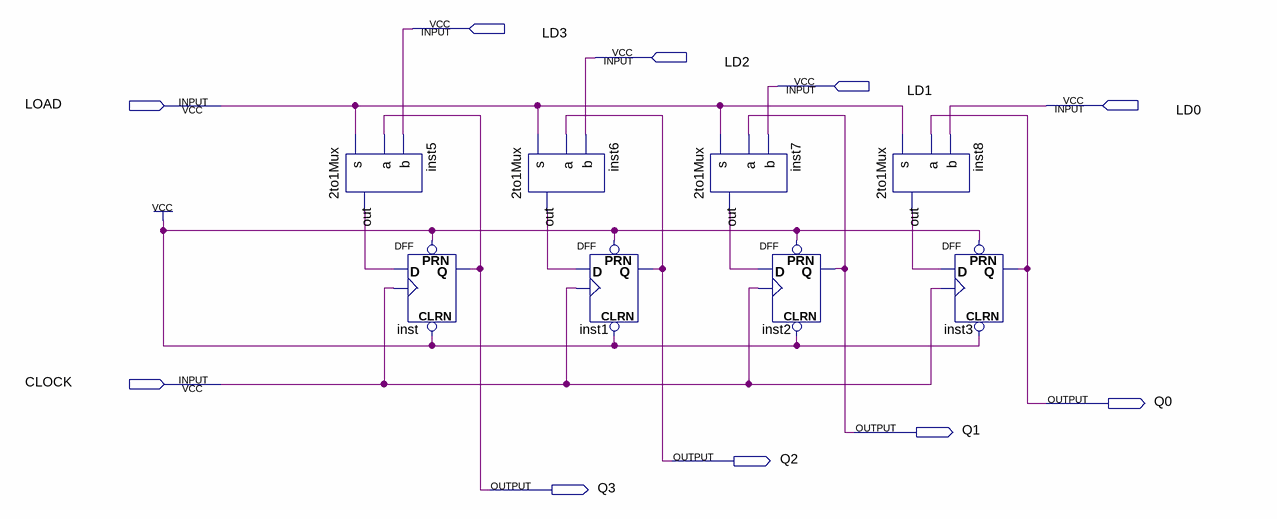
[diagram p0: schematic sheet]
// Quartus schematic register.bdf as structural Verilog: 8 symbols, 10 pins
module register (
  input  LD3,
  input  LD2,
  input  LD1,
  input  LOAD,
  input  LD0,
  input  CLOCK,
  output Q0,
  output Q1,
  output Q2,
  output Q3
);

  wire inst5_out, inst6_out, inst7_out, inst8_out;

  \2to1Mux  inst5 (.a(Q3), .s(LOAD), .b(LD3), .out(inst5_out));
  DFF inst (.CLRN(1'b1), .CLK(CLOCK), .D(inst5_out), .PRN(1'b1), .Q(Q3));
  \2to1Mux  inst6 (.a(Q2), .s(LOAD), .b(LD2), .out(inst6_out));
  DFF inst1 (.CLRN(1'b1), .CLK(CLOCK), .D(inst6_out), .PRN(1'b1), .Q(Q2));
  \2to1Mux  inst7 (.a(Q1), .s(LOAD), .b(LD1), .out(inst7_out));
  DFF inst2 (.CLRN(1'b1), .CLK(CLOCK), .D(inst7_out), .PRN(1'b1), .Q(Q1));
  \2to1Mux  inst8 (.a(Q0), .s(LOAD), .b(LD0), .out(inst8_out));
  DFF inst3 (.CLRN(1'b1), .CLK(CLOCK), .D(inst8_out), .PRN(1'b1), .Q(Q0));
endmodule
